# EAGLE design 0216-carrier-class-d-3w (EAGLE 9.6.2)
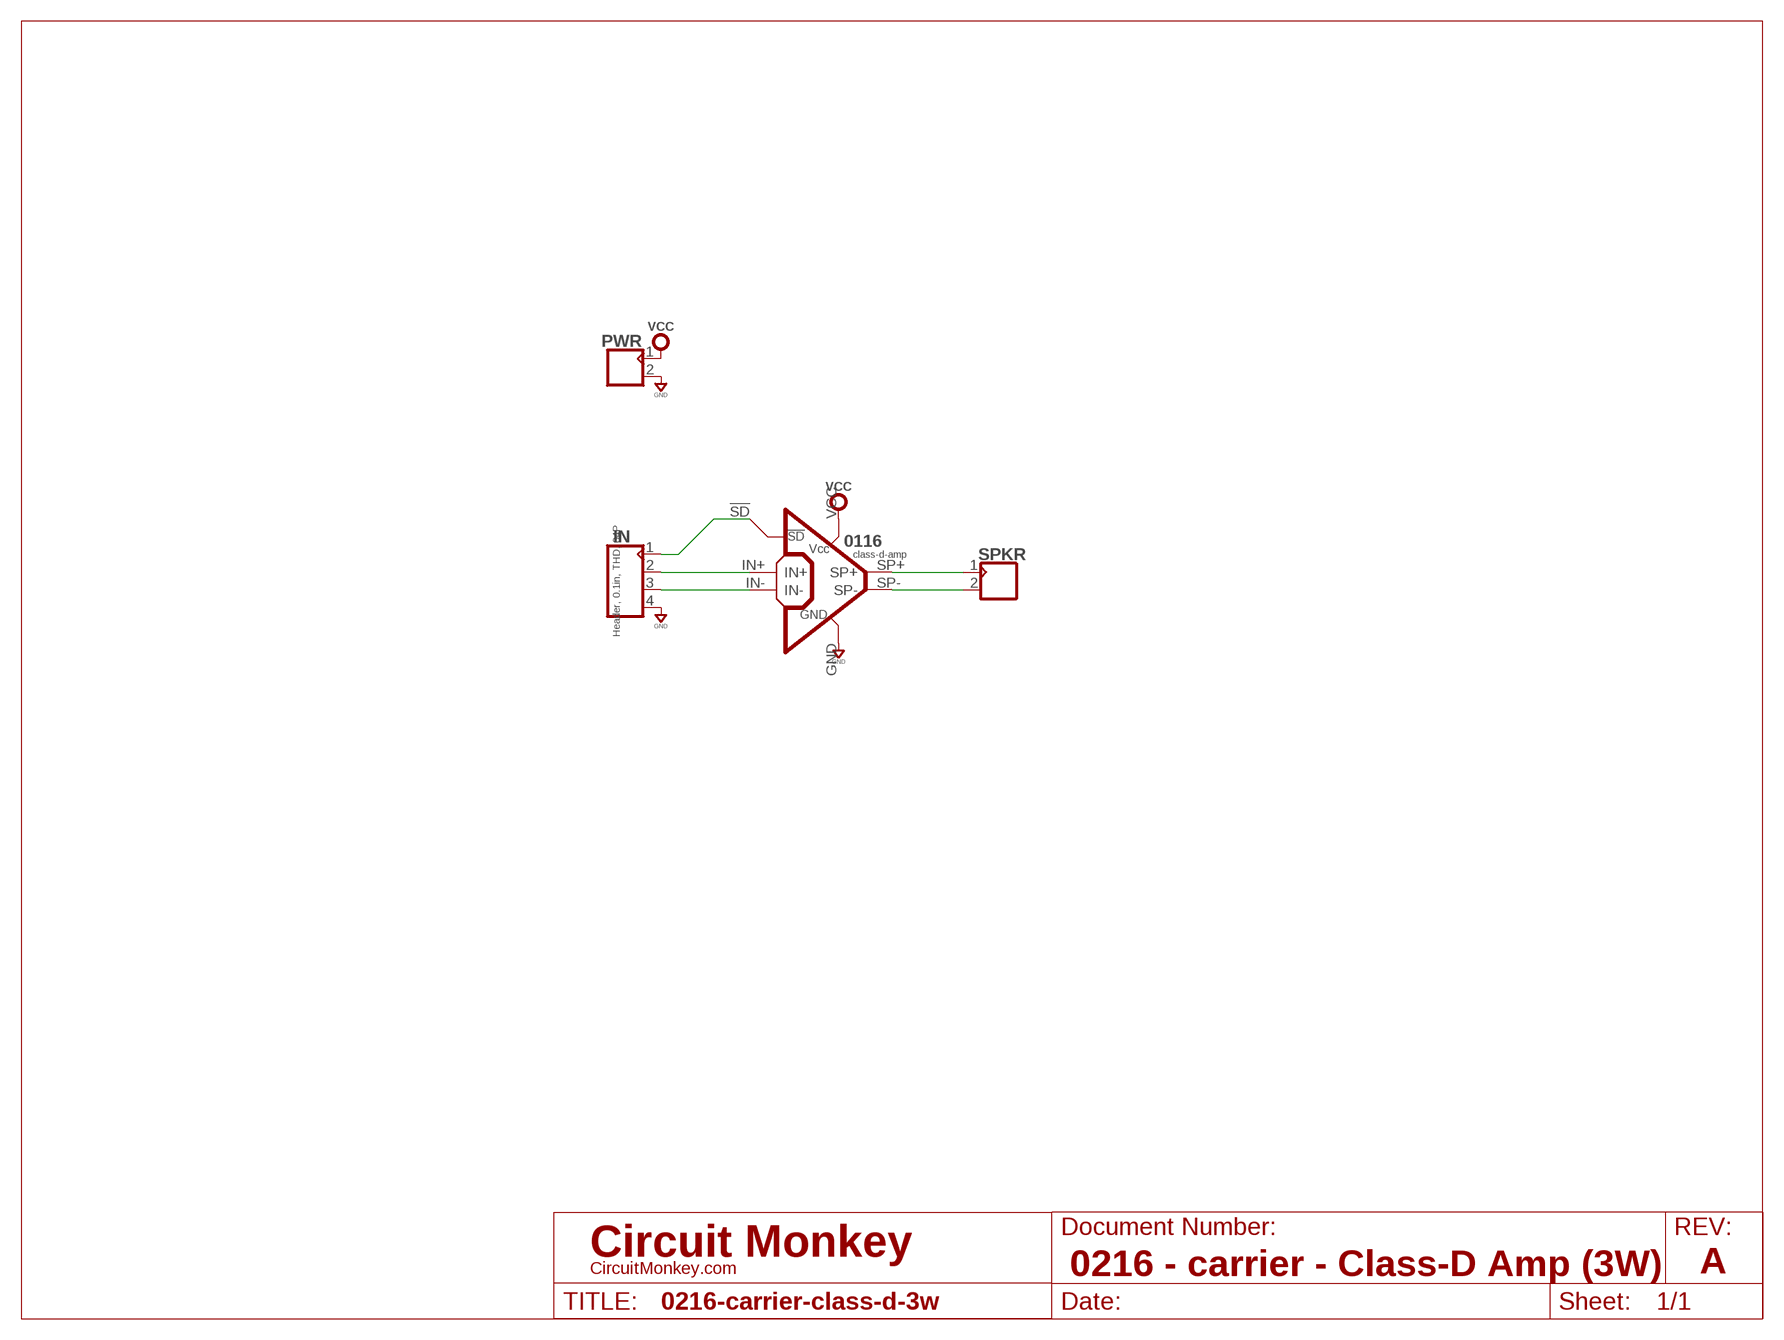
[diagram p0: schematic, sheet 1]
SHEET1 (LETTER_L-CIRCUITMONKEY): DOCUMENT_NUMBER: 0216 - carrier - Class-D Amp (3W); REV: A

## Parts
0116  class-d-amp  0116REV-A  [0116A]
IN  Header, 0.1in, THD, 04P  CON_04X1-THD-VT  [MA04X1-VT-THD]
PWR  CON_02X1-2.54MM-THD-VT  [MA02X1-VT-THD]
SPKR  CON_02X1-2.54MM-THD-VT  [MA02X1-VT-THD]

## Nets
GND: 0116.GND IN.4 PWR.2
N$1: 0116.IN- IN.3
N$2: 0116.IN+ IN.2
N$3: 0116.!SD IN.1
N$4: 0116.SP- SPKR.2
N$5: 0116.SP+ SPKR.1
VCC: 0116.VCC PWR.1

## Library data of the parts
0116 = circuit-monkey-chips:0116: Circuit Monkey CHIPs #0116 - Class-D Audio Amplifier; MFR: Circuit Monkey; MPN: 0116A
IN = con-headers:CON_04X1: Headers, 04 pin; MFR: Molex; MPN: 022284043
PWR SPKR = con-headers:CON_02X1: Connector, 2P

## Board
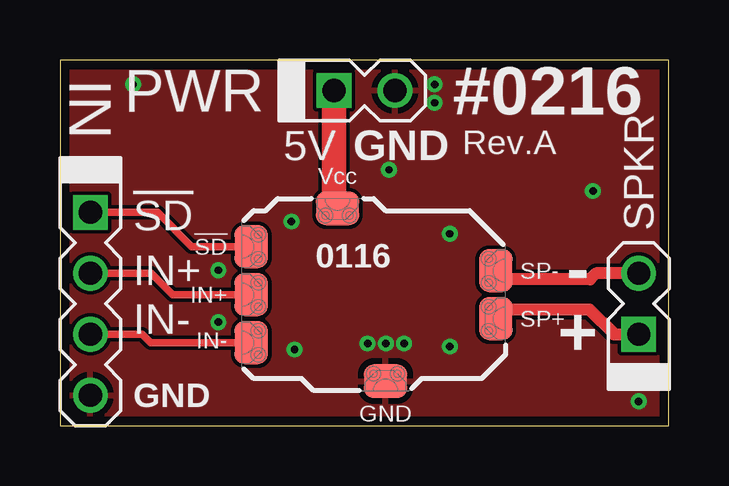
[diagram p1: board, top side]
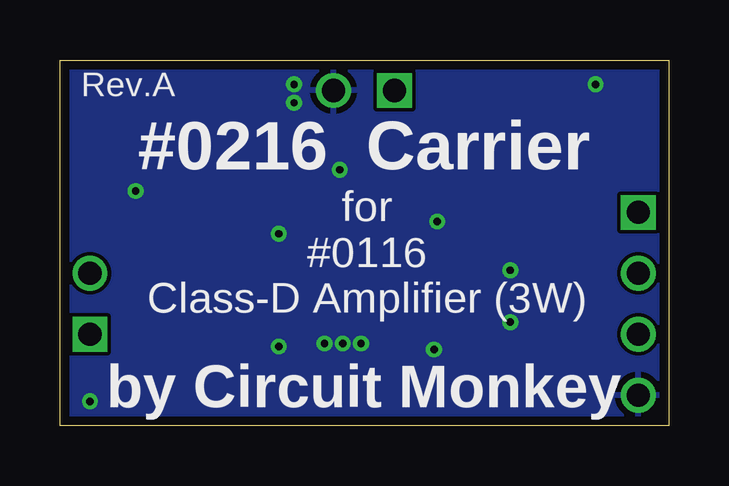
[diagram p2: board, bottom side, seen from below]

Size 25.38 x 15.24 mm. Coordinates in mm from the lower left corner, seen from the top.
Outline: 0,0 25.38,0 25.38,15.24 0,15.24 0,0
Copper layers (1*16): Top 0.0356mm / dielectric 1.5011mm / Bottom 0.0356mm
Design rules "OSH-CircuitMonkey *": minimum track width 6mil, minimum drill 12mil, track to track 6mil, track to pad 6mil, pad to pad 6mil, via to via 6mil, smd to smd 6mil, copper to edge 15mil, drill to drill 6mil, minimum pad ring 7mil, minimum via ring 7mil, stop-mask expansion 3mil, vias tented up to drill 13mil, thermal gap 10mil

### Footprints (pad centres in the part's own frame; a part is rotated, then mirrored left to right if it is on the bottom)
0116A = smd 1.4 x 1.8: !SD -4.6,2; IN+ -4.6,0; IN- -4.6,-2; SP+ 5.6,-1; SP- 5.6,1 | smd 1.8 x 1.4: GND 1,-3.6; VCC -1,3.6
MA04X1-VT-THD = drill 0.965 square: 1 -3.81,0 | drill 0.965: 2 -1.27,0; 3 1.27,0; 4 3.81,0
MA02X1-VT-THD = drill 0.965 square: 1 -1.27,0 | drill 0.965: 2 1.27,0

### Placement (x,y rotation side)
0116  12.57,5.46 0 top
IN  1.27,5.08 270 top
PWR  12.7,13.97 0 top
SPKR  24.13,5.08 90 top

### Tracks (layer width: path | path; a pad name or v marks a point on that pad's centre or on a via)
GND  (via drill 0.3)
  other vias: 3.05,14.22 9.78,3.17 16.26,8 9.65,8.51 16.26,3.3 13.59,3.43 12.83,3.43 14.35,3.43 24.13,1.02 22.23,9.78 15.62,13.46 15.62,14.22 13.72,10.67 6.6,6.48 6.6,4.32
  pour Top: 0,0 25.4,0 25.4,15.24 0,15.24
  pour Bottom: 25.4,0 0,0 0,15.24 25.4,15.24
N$1
  Top 0.305: 0116.IN- 3.78,3.46 3.43,3.81 IN.3
N$2
  Top 0.305: 0116.IN+ 4.7,5.46 3.81,6.35 IN.2
N$3
  Top 0.305: 0116.!SD 5.49,7.46 4.06,8.89 IN.1
N$4
  Top 0.508: SPKR.2 22.35,6.35 22.1,6.1 18.54,6.1 0116.SP-
N$5
  Top 0.508: 0116.SP+ 18.55,4.84 22.08,4.84 23.11,3.81 SPKR.1
VCC
  Top 1.016: PWR.1 11.43,9.2 0116.VCC

### Text on the board
tPlace: #0216 | 5V | GND | Rev.A | !SD | - | IN+ | IN- | + | GND
bPlace: Rev.A | #0216 Carrier | for / #0116 / Class-D Amplifier (3W) | by Circuit Monkey